# Altium schematic sheet ST_LINK_V2-1.SCHDOC: ST-LINK/V2-1 with support of SWD only
size A4; Author: N.P; CompanyName: STMicroelectronics; Organization: MCD/APPLIS/LMS; DocumentNumber: 3; SheetNumber: 3; SheetTotal: 13; Project: STM32F723e-DISCO
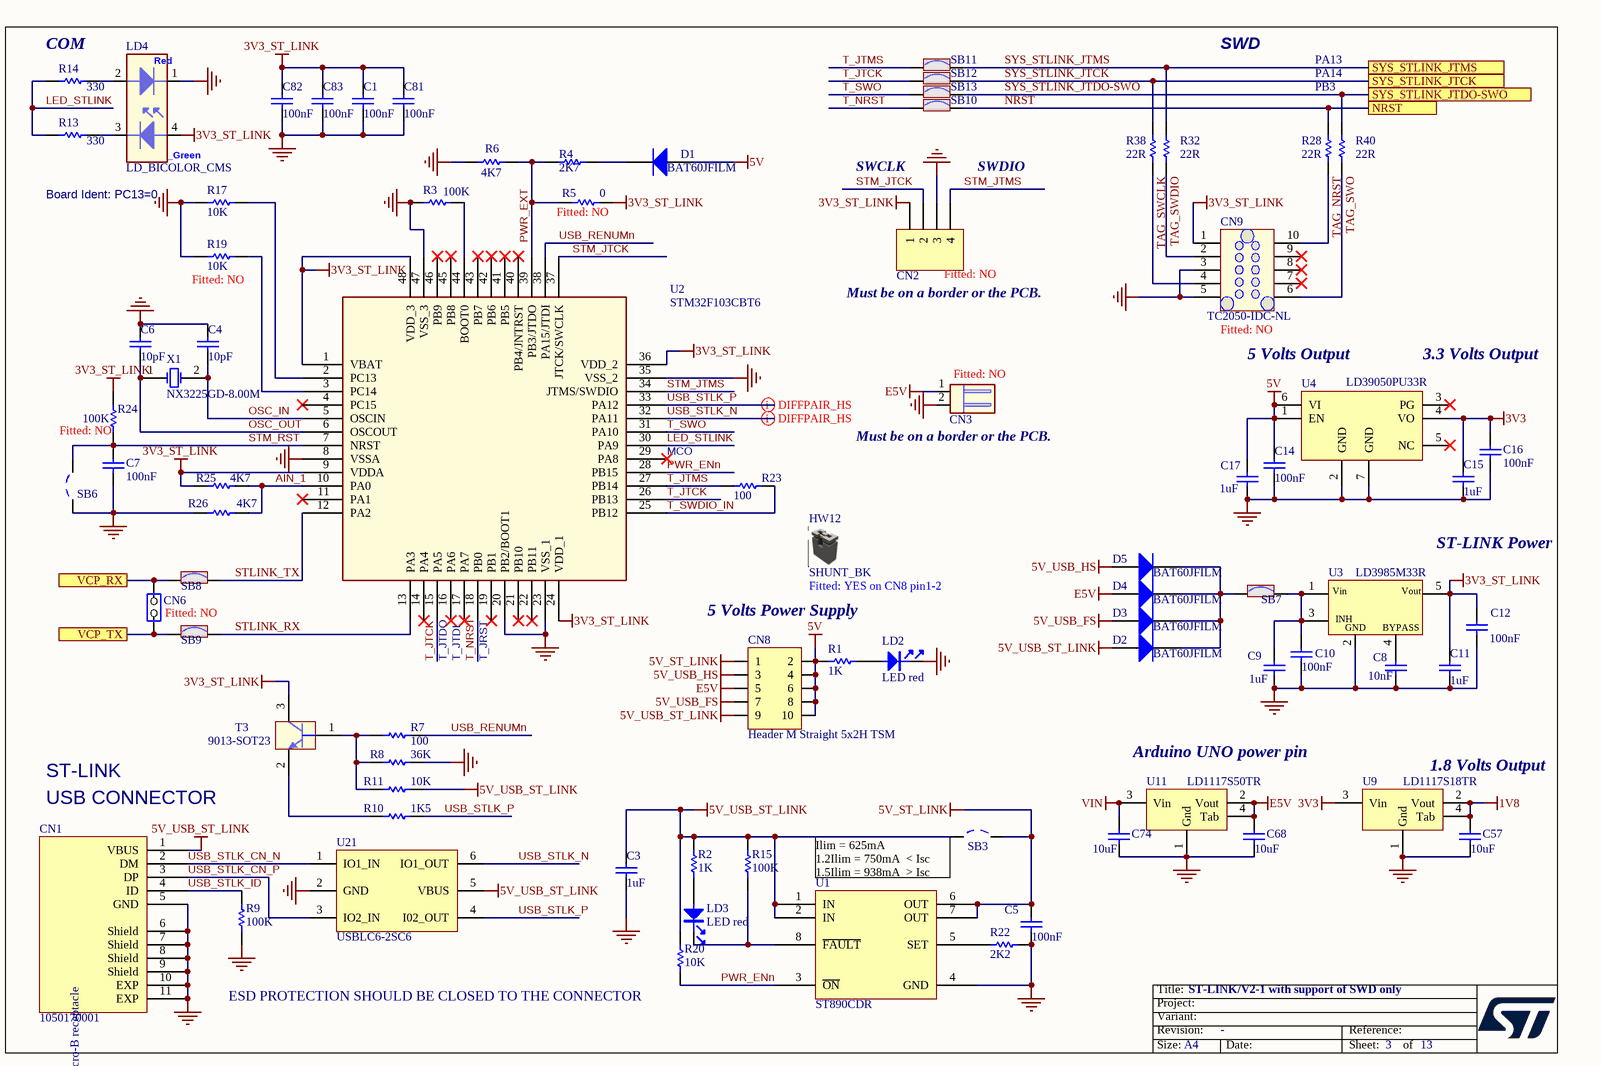
[diagram p0: ST_LINK_V2-1.SCHDOC]

## Parts
C1  100nF  [0402C]
C3  1uF  [0603C]
C4  10pF  [0402C]
C5  100nF  [0402C]
C6  10pF  [0402C]
C7  100nF  [0402C]
C8  value 10nF  [0603C]  (hidden comment: 10nF_X7R_10%_0603)
C9  1uF  [0603C]
C10  100nF  [0402C]
C11  1uF  [0603C]
C12  100nF  [0402C]
C14  100nF  [0402C]
C15  1uF  [0603C]
C16  100nF  [0402C]
C17  1uF  [0603C]
C57  10uF  [0603C]
C68  10uF  [0805C]
C74  10uF  [0805C]
C81  100nF  [0402C]
C82  100nF  [0402C]
C83  100nF  [0402C]
CN1  1050170001  [MICRO_USB_B_105017]
CN2  Fitted: NO  [HDR_1X4_2R54]  (hidden comment: Header 4)
CN3  Fitted: NO  [HDR_1X2_2R54_RA_11R35]  (hidden comment: WF25402-06421)
CN6  Fitted: NO  [SIP2]  (hidden comment: JP2)
CN8  Header M Straight 5x2H TSM  [TSM-105-01-S-DV]
CN9  TC2050-IDC-NL  Fitted: NO  [TC2050-IDC-NL]
D1  BAT60JFILM  [SOD-323]
D2  BAT60JFILM  [SOD-323]
D3  BAT60JFILM  [SOD-323]
D4  BAT60JFILM  [SOD-323]
D5  BAT60JFILM  [SOD-323]
HW12  SHUNT_BK  Fitted: YES on CN8 pin1-2  (mechanical)
LD2  LED red  [0603D]
LD3  LED red  [0603D]
LD4  LD_BICOLOR_CMS  [LED2_3528]
R1  1K  [0402R]
R2  1K  [0402R]
R3  value 100K  [0402R]  (hidden comment: 100K_1%_0402)
R4  2K7  [0402R]
R5  Fitted: NO  [0402R]  (hidden comment: 0)
R6  value 4K7  [0402R]  (hidden comment: 4K7_1%_0402)
R7  100  [0402R]
R8  36K  [0402R]
R9  value 100K  [0402R]  (hidden comment: 100K_1%_0402)
R10  1K5  [0402R]
R11  10K  [0402R]
R13  330  [0402R]
R14  330  [0402R]
R15  value 100K  [0402R]  (hidden comment: 100K_1%_0402)
R17  10K  [0402R]
R19  10K  Fitted: NO  [0402R]
R20  10K  [0402R]
R22  2K2  [0402R]
R23  100  [0402R]
R24  value 100K  Fitted: NO  [0402R]  (hidden comment: 100K_1%_0402)
R25  value 4K7  [0402R]  (hidden comment: 4K7_1%_0402)
R26  value 4K7  [0402R]  (hidden comment: 4K7_1%_0402)
R28  22R  [R0603]
R32  22R  [R0603]
R38  22R  [R0603]
R40  22R  [R0603]
SB3  Solder Bridge OFF  [JP2_SMD]  (value not drawn)
SB6  Solder Bridge OFF  [JP2_SMD]  (value not drawn)
SB7  Solder Bridge ON  [JP2_SMD]  (value not drawn)
SB8  Solder Bridge ON  [JP2_SMD]  (value not drawn)
SB9  Solder Bridge ON  [JP2_SMD]  (value not drawn)
SB10  Solder Bridge ON  [JP2_SMD]  (value not drawn)
SB11  Solder Bridge ON  [JP2_SMD]  (value not drawn)
SB12  Solder Bridge ON  [JP2_SMD]  (value not drawn)
SB13  Solder Bridge ON  [JP2_SMD]  (value not drawn)
T3  9013-SOT23  [SOT-23]
U1  ST890CDR  [SOIC8_1R27_4R9X6]
U2  STM32F103CBT6  [LQFP48_0R5_9X9]
U3  LD3985M33R  [SOT-23-5L]
U4  LD39050PU33R  [DFN6_0R95_3X3]
U9  LD1117S18TR  [SOT-223]
U11  LD1117S50TR  [SOT-223]
U21  USBLC6-2SC6  [SOT23-6]
X1  NX3225GD-8.00M  [XTAL_2SM_3R2X2R5_H1]

## Ports
NRST, SYS_STLINK_JTCK, SYS_STLINK_JTDO-SWO, SYS_STLINK_JTMS, VCP_RX, VCP_TX

## Nets
1V8: C57.2 U9.2(Vout) U9.4(Tab)
3V3: C15.2 C16.2 U4.4(VO) U9.3(Vin)
3V3_ST_LINK: C1.1 C11.2 C12.2 C81.2 C82.2 C83.2 CN2.1 CN9.1 LD4.4 R5.2 R24.2 R25.1 T3.3(C) U2.1(VBAT) U2.9(VDDA) U2.24(VDD_1) U2.36(VDD_2) U2.48(VDD_3) U3.5(Vout)
5V: C14.2 C17.2 CN8.2 CN8.4 CN8.6 CN8.8 CN8.10 D1.1(A) R1.1 U4.1(EN) U4.6(VI)
5V_ST_LINK: C5.2 CN8.1 SB3.2 U1.6(OUT) U1.7(OUT)
5V_USB_FS: CN8.7 D3.1(A)
5V_USB_HS: CN8.3 D5.1(A)
5V_USB_ST_LINK: C3.2 CN1.1(VBUS) CN8.9 D2.1(A) R2.2 R11.1 R15.2 R20.2 SB3.1 U1.1(IN) U1.2(IN) U21.5(VBUS)
E5V: C68.2 CN3.1 CN8.5 D4.1(A) U11.2(Vout) U11.4(Tab)
GND: C1.2 C3.1 C4.1 C5.1 C6.1 C7.1 C8.1 C9.1 C10.1 C11.1 C12.1 C14.1 C15.1 C16.1 C17.1 C57.1 C68.1 C74.1 C81.1 C82.1 C83.1 CN1.5(GND) CN1.6(Shield) CN1.7(Shield) CN1.8(Shield) CN1.9(Shield) CN1.10(EXP) CN1.11(EXP) CN2.3 CN3.2 CN9.3 CN9.5 LD2.2 LD4.1 R3.1 R6.1 R8.1 R9.1 R17.1 R19.1 R22.2 R26.1 SB6.1 U1.4(GND) U2.8(VSSA) U2.20(PB2/BOOT1) U2.23(VSS_1) U2.35(VSS_2) U2.47(VSS_3) U3.2(GND) U4.2(GND) U4.7(GND) U9.1(Gnd) U11.1(Gnd) U21.2(GND)
VIN: C74.2 U11.3(Vin)
AIN_1: R25.2 R26.2 U2.10(PA0)
LED_STLINK: R13.1 R14.1 U2.30(PA9)
NRST: R28.2 SB10.2 ; port NRST
OSC_IN: C4.2 U2.5(OSCIN) X1.2(OSC2)
OSC_OUT: C6.2 U2.6(OSCOUT) X1.1(OSC1)
PWR_ENn: R20.1 U1.3(~{ON}) U2.28(PB15)
PWR_EXT: R4.1 R5.1 R6.2 U2.39(PB3/JTDO)
STLINK_RX: SB9.2 U2.13(PA3)
STLINK_TX: SB8.2 U2.12(PA2)
STM_JTCK: CN2.2 U2.37(JTCK/SWCLK)
STM_JTMS: CN2.4 U2.34(JTMS/SWDIO)
STM_RST: C7.2 R24.1 SB6.2 U2.7(NRST)
SYS_STLINK_JTCK: R38.2 SB12.2 ; port SYS_STLINK_JTCK
SYS_STLINK_JTDO-SWO: R40.2 SB13.2 ; port SYS_STLINK_JTDO-SWO
SYS_STLINK_JTMS: R32.2 SB11.2 ; port SYS_STLINK_JTMS
T_JTCK: SB12.1 U2.15(PA5) U2.26(PB13)
T_JTMS: R23.1 SB11.1 U2.27(PB14)
T_NRST: SB10.1 U2.18(PB0)
T_SWDIO_IN: R23.2 U2.25(PB12)
T_SWO: SB13.1 U2.31(PA10)
TAG_NRST: CN9.10 R28.1
TAG_SWCLK: CN9.4 R38.1
TAG_SWDIO: CN9.2 R32.1
TAG_SWO: CN9.6 R40.1
USB_RENUMn: R7.2 U2.38(PA15/JTDI)
USB_STLK_CN_N: CN1.2(DM) U21.1(IO1_IN)
USB_STLK_CN_P: CN1.3(DP) U21.3(IO2_IN)
USB_STLK_ID: CN1.4(ID) R9.2
USB_STLK_N: U2.32(PA11) U21.6(IO1_OUT)
USB_STLK_P: R10.2 U2.33(PA12) U21.4(I02_OUT)
VCP_RX: CN6.2(NO) SB8.1 ; port VCP_RX
VCP_TX: CN6.1(COMMON) SB9.1 ; port VCP_TX
NetC8_2: C8.2 U3.4(BYPASS)
NetC9_2: C9.2 C10.2 SB7.2 U3.1(Vin) U3.3(CE)
NetD1_2: D1.2(K) R4.2
NetD2_2: D2.2(K) D3.2(K) D4.2(K) D5.2(K) SB7.1
NetLD2_1: LD2.1 R1.2
NetLD3_1: LD3.1 R2.1
NetLD3_2: LD3.2 R15.1 U1.8(~{FAULT})
NetLD4_2: LD4.2 R14.2
NetLD4_3: LD4.3 R13.2
NetR3_2: R3.2 U2.44(BOOT0)
NetR7_1: R7.1 R8.2 R11.2 T3.1(B)
NetR10_1: R10.1 T3.2(E)
NetR17_2: R17.2 U2.2(PC13)
NetR19_2: R19.2 U2.3(PC14)
NetR22_1: R22.1 U1.5(SET)

Not connected (* = marked no-connect by the designer): CN9 7* 8* 9*; U2 4(PC15)* 11(PA1)* 14(PA4)* 16(PA6)* 17(PA7)* 19(PB1)* 21(PB10)* 22(PB11)* 29(PA8)* 40(PB4/JNTRST)* 41(PB5)* 42(PB6)* 43(PB7)* 45(PB8)* 46(PB9)*; U4 3(PG)* 5(NC)*

## Layout directives
differential pair: USB_STLK_N, USB_STLK_P

## Notes on the sheet
- (near R14) COM
- SWD
- PA13
- PB3
- PA14
- Board Ident: PC13=0
- SWCLK
- SWDIO
- Must be on a border or the PCB.
- 5 Volts Output
- (near U4) 3.3 Volts Output
- MCO
- (near CN3) Must be on a border or the PCB.
- ST-LINK Power
- (near U2) T_JTDO
- (near U2) T_JTDI
- (near U2) T_JRST
- 5 Volts Power Supply
- ST-LINK
- (near CN1) USB CONNECTOR
- (near U11) Arduino UNO power pin
- (near U9) 1.8 Volts Output
- (near SB3) Ilim = 625mA
  1.2Ilim = 750mA  < Isc
  1.5Ilim = 938mA  > Isc
- ESD PROTECTION SHOULD BE CLOSED TO THE CONNECTOR
- Title:
- Project:
- Size:
- Revision:
- Variant:
- A4
- -
- Date:
- Reference:
- Sheet:
- of
- (in symbol 1050170001) USB_Micro-B receptacle
- (in symbol LD3985M33R) INH
- (in symbol LD_BICOLOR_CMS) Red; _Green

## Library data of the parts
C1 C5 C7 C10 C12 C14 C16 C81-C83 = Cap_100nF_X7R_10%_0402: Capacitor,100nF,16V,X7R,10%,0402,YAGEO; Manuf_Part_1: CC0402KRX7R7BB104; Ordered by: Subcon; Fitted: YES; Revision: July-2002: Re-released for DXP Platform.; Value: 100nF; Order: CC0402KRX7R7BB104; Manuf_1: YAGEO; ECCN_US/EU: n/a
C3 C9 C11 C15 C17 = Cap_1uF_X5R_10%_0603: Capacitor,1uF,16V,X5R,10%,0603,YAGEO; Manuf_Part_1: CC0603KRX5R7BB105; Ordered by: Subcon; Fitted: YES; Revision: July-2002: Re-released for DXP Platform.; Value: 1uF; Order: CC0603KRX5R7BB105; Manuf_1: YAGEO; ECCN_US/EU: n/a
C4 C6 = Cap_10pF_NPO_5%_0402: Capacitor,10pF,50V,NPO,5%,0402,YAGEO; Order: CC0402JRNPO9BN100; Ordered by: Subcon; Fitted: YES; Revision: July-2002: Re-released for DXP Platform.; Value: 10pF; Manuf_1: YAGEO; Manuf_Part_1: CC0402JRNPO9BN100; ECCN_US/EU: n/a
C8 = Cap_10nF_X7R_10%_0603: Capacitor,10nF,50V,X7R,10%,0603,YAGEO; Manuf_Part_1: CC0603KRX7R9BB103; Ordered by: Subcon; Fitted: YES; Revision: July-2002: Re-released for DXP Platform.; Order: CC0603KRX7R9BB103; Manuf_1: YAGEO; ECCN_US/EU: n/a
C57 = Cap_10uF_X5R_10%_0603: Capacitor,10uF,6.3V,X5R,10%,0603,YAGEO; Manuf_Part_1: CC0603KRX5R5BB106; Ordered by: Subcon; Fitted: YES; Revision: July-2002: Re-released for DXP Platform.; Value: 10uF; Order: CC0603KRX5R5BB106; Manuf_1: YAGEO; ECCN_US/EU: n/a
C68 C74 = Cap_10uF_X5R_10%_0805: Capacitor,10uF,25V,X5R,10%,0805,YAGEO; Manuf_Part_1: CC0805KRX5R8BB106; Ordered by: Subcon; Fitted: YES; Revision: July-2002: Re-released for DXP Platform.; Value: 10uF; Order: CC0805KRX5R8BB106; Manuf_1: YAGEO; ECCN_US/EU: n/a
CN1 = 1050170001: USB-MICRO-B, 1050170001, SMT, MOLEX; Ordered by: Subcon; Fitted: YES; ECCN_US/EU: n/a; Manuf_1: MOLEX; Manuf_Part_1: 1050170001; Distrib: DIGIKEY; SOFER_FP: MICRO_USB_B_105017
CN2 = Header 4: Header, 4-Pin; Ordered by: Subcon; Revision: 17-Jul-2002: Re-released for DXP Platform.; Publisher: Altium Limited; ECCN_US/EU: n/a; SOFER_FP: HDR_1X4_2R54
CN3 = JP2_RA: Header, 2-Pins, Single row, Right Angle, 2.54 mm pitch, DIP; Manuf_1: ATOM; Ordered by: Subcon; ECCN_US/EU: n/a; Manuf_Part_1: WF25402-06421; Distrib: SubCo
CN6 = JP2: Ordered by: Subcon; ECCN_US/EU: n/a
CN8 = Header 5X2M TSM: Header Male TSM, 5-Pin, Dual row, Straight, AMD; Manuf_Part_1: TSM-105-01-L-DV; Manuf_1: SAMTEC; Fitted: YES; Ordered by: Subcon; Distrib: Sub Co; Footprint: TSM-105-01-L-DV; ECCN_US/EU: n/a; SOFER_FP: TSM-105-01-L-DV
CN9 = Tag-10-C: Tag_Connector Header, 10-Pin, Dual row No legs; Manuf_Part_1: TC2050-IDC-NL-FP; Ordered_By: Subcon; Distrib: *; ECCN_US/EU: n/a; Manuf_1: Tag_connect; Order_code: *; Value: TC2050-IDC-NL; Ordered by: Subcon
D1-D5 = BAT60JFILM: Manuf_1: STM; Provided: ST; ECCN_US/EU: EAR99/NEC; Ref St: 9151097; Fitted: YES; Revision: July-2002: Re-released for DXP Platform.; Order: BAT60JFILM; Manuf_Part_1: BAT60JFILM; Distrib: ST; Ordered by: ST
HW12 = Shunt 2.54mm: SHUNT 2.54mm BLACK; Manuf_1: SAMTEC; Manuf_Part_1: SNT-100-BK-G; Ordered_By: Subcon; ECCN_US/EU: n/a; Distrib: *; Order_Code: *; Value: SHUNT_BK; Ordered by: Subcon
LD2 LD3 = LED_red: LED red 0603; Manuf_1: everlight; Manuf_Part_1: 19-213-R6C-AP1Q2B/3T; Ordered by: Subcon; Fitted: YES; Order: 19-213-R6C-AP1Q2B/3T; ECCN_US/EU: n/a
LD4 = LD_BICOLOR_CMS: Bicolor Led; Manuf_Part_1: HSMF-A201-A00J1; Manuf_1: Avago Technologies; Manuf_2: everluck; Manuf_Part_2: LE-RGW35280; Ref St: xxxxxx; Ordered by: Subcon; Fitted: YES; Distrib: RADIOSPARES; Footprint: HSMF-A201; ECCN_US/EU: n/a
R1 R2 = Res_1K_1%_0402: Resistor,1K,0402,1%,YAGEO; Manuf_Part_1: RC0402FR-071KL; Ordered by: Subcon; Fitted: YES; Value: 1K; Manuf_1: YAGEO; Order: RC0402FR-071KL; ECCN_US/EU: n/a
R3 R9 R15 = Res_100K_1%_0402: Resistor,100K,0402,1%,YAGEO; Manuf_Part_1: RC0402FR-07100KL; Manuf_Part_2: RT0402FRE07100KL; Ordered by: Subcon; Fitted: YES; Manuf_1: YAGEO; ECCN_US/EU: n/a; Manuf_2: YAGEO
R4 = Res_2K7_1%_0402: Resistor,2K7,0402,1%,YAGEO; Manuf_Part_1: RC0402FR-072K7L; Ordered by: Subcon; Fitted: YES; Value: 2K7; Manuf_1: YAGEO; Order: RC0402FR-072K7L; ECCN_US/EU: n/a; Distrib: FARNELL
R5 = Res_0_5%_0402: Resistor,0,0402,5%,YAGEO; Manuf_Part_1: RC0402JR-070RL; Order: 2363467; Ordered by: Subcon; Value: 0; ECCN_US/EU: n/a; Manuf_1: YAGEO; Distrib: FARNELL
R6 R25 R26 = Res_4K7_1%_0402: Resistor,4K7,0402,1%,YAGEO; Manuf_Part_1: RC0402FR-074K7L; Manuf_Part_2: RT0402FRE074K7L; Ordered by: Subcon; Fitted: YES; Manuf_1: YAGEO; ECCN_US/EU: n/a; Manuf_2: YAGEO
R7 R23 = Res_100_1%_0402: Resistor,100,0402,1%,YAGEO; Manuf_Part_1: RC0402FR-07100RL; Order: 9239111; Ordered by: Subcon; Fitted: YES; Value: 100; Manuf_1: YAGEO; ECCN_US/EU: n/a; Distrib: FARNELL
R8 = Res_36K_1%_0402: Resistor,36K,0402,1%,YAGEO; Manuf_Part_1: RC0402FR-0736KL; Ordered by: Subcon; Fitted: YES; Value: 36K; Manuf_1: YAGEO; Order: RC0402FR-0736KL; ECCN_US/EU: n/a; Distrib: FARNELL
R10 = Res_1K5_1%_0402: Resistor,1K5,0402,1%,YAGEO; Manuf_Part_1: RC0402FR-071K5L; Ordered by: Subcon; Fitted: YES; Value: 1K5; Manuf_1: YAGEO; Order: RC0402FR-071K5L; ECCN_US/EU: n/a; Distrib: FARNELL
R11 R17 R20 = Res_10K_1%_0402: Resistor,10K,0402,1%,YAGEO; Manuf_Part_1: RC0402FR-0710KL; Ordered by: Subcon; Fitted: YES; Value: 10K; Manuf_1: YAGEO; Order: RC0402FR-0710KL; ECCN_US/EU: n/a
R13 R14 = Res_330_1%_0402: Resistor,330,0402,1%,YAGEO; Manuf_Part_1: RC0402FR-07330RL; Ordered by: Subcon; Fitted: YES; Value: 330; ECCN_US/EU: n/a; Manuf_1: YAGEO; Distrib: DIGIKEY; Order: RC0402FR-07330RL
R19 = Res_10K_1%_0402: Resistor,10K,0402,1%,YAGEO; Manuf_Part_1: RC0402FR-0710KL; Ordered by: Subcon; Value: 10K; Manuf_1: YAGEO; Order: RC0402FR-0710KL; ECCN_US/EU: n/a
R22 = Res_2K2_1%_0402: Resistor,2K2,0402,1%,YAGEO; Manuf_Part_1: RC0402FR-072K2L; Ordered by: Subcon; Fitted: YES; Value: 2K2; Manuf_1: YAGEO; Order: RC0402FR-072K2L; ECCN_US/EU: n/a
R24 = Res_100K_1%_0402: Resistor,100K,0402,1%,YAGEO; Manuf_Part_1: RC0402FR-07100KL; Manuf_Part_2: RT0402FRE07100KL; Ordered by: Subcon; Manuf_1: YAGEO; ECCN_US/EU: n/a; Manuf_2: YAGEO
R28 R32 R38 R40 = Res_22_1%_0603: Resistor,22R,0603,1%,Yageo; Manuf_Part_1: RC0603FR-0722RL; Fitted: YES; Ordered_By: Subcon; Value: 22R; ECCN_US/EU: n/a; Manuf_1: Yageo; Order_Code: RC0603FR-0722RL; Distrib: *; Ordered by: Subcon
SB3 SB6 = SB_OFF: Fitted: NO; Ordered by: Subcon; Revision: July-2002: Re-released for DXP Platform.; ECCN_US/EU: n/a
SB7-SB13 = SB_ON: Fitted: YES; Ordered by: Subcon; Revision: July-2002: Re-released for DXP Platform.; ECCN_US/EU: n/a
T3 = 9013-SOT23: NPN Bipolar Transistor; Manuf_1: NXP; Manuf_Part_1: BSR14; Order: 1081310; Ordered by: Subcon; Fitted: YES; Revision: July-2002: Re-released for DXP Platform.; Distrib: FARNELL; ECCN_US/EU: n/a
U1 = ST890CDR: 1.2 A current limited high-side power switch with thermal shutdown; Manuf_1: STM; ECCN_US/EU: EAR99/NEC; Provided: ST; Fitted: YES; Manuf_Part_1: ST890CDR; Distrib: ST; Footprint: SO-8; Ordered by: ST
U2 = STM32F103CBT6: Medium-density performance line ARM-based 32-bit MCU with 128KB Flash; Manuf_1: STM; Ref St: xxxxxxxx; Provided: ST; ECCN_US/EU: 3A991A2/NEC; Fitted: YES; Footprint: QFP48 7X7; Manuf_Part_1: STM32F103CBT6; Order: STM32F103CBT6; Distrib: ST; Ordered by: ST
U3 = LD3985M33R: Ultra low drop-low noise BiCMOS voltage, regulators low ESR capacitors compatible; Manuf_1: STM; Provided: ST; Ref St: 9176161; ECCN_US/EU: EAR99/NEC; Fitted: YES; Manuf_Part_1: LD3985M33R; Distrib: ST; Order: LD3985M33R; Ordered by: ST
U4 = LD39050P: Ultra low drop-low , 500 mA low quiescent current; Manuf_1: STM; Provided: ST; ECCN_US/EU: EAR99/NEC; Ref St: xxxxxxxx; Fitted: YES; Distrib: ST; Manuf_Part_1: LD39050PU33R; Order: LD39050PU33R; Ordered by: ST
U9 = LD1117S18TR: LOW DROP FIXED AND ADJUSTABLE POSITIVE VOLTAGE REGULATORS (1.8 Volts); Manuf_1: STM; Ref St: 9176180; ECCN_US/EU: EAR99/NEC; Provided: ST; Fitted: YES; Manuf_Part_1: LD1117S18TR; Order: LD1117S18TR; Distrib: ST; Ordered by: ST
U11 = LD1117S50TR: IC REG LDO 5V 0.8A SOT223; Manuf_1: STM; Ordered by: ST; ECCN_US/EU: EAR99/NEC; Ref St: 9176133; Fitted: YES; Manuf_Part_1: LD1117S50TR; Distrib: ST; Order: LD1117S50TR; Provided: ST
U21 = USBLC6-2SC6: Very low capacitance ESD protection; Manuf_1: STM; Provided: ST; ECCN_US/EU: EAR99/NEC; Fitted: YES; Manuf_Part_1: USBLC6-2SC6; Distrib: ST; Ordered by: ST
X1 = XTAL_8M_NX3225GD: Crystal 8Mhz, 8pF, -+50PPM, SMD; Manuf_1: NDK; Manuf_Part_1: NX3225GD 8MHz EXS00A-CG04874; Manuf_Part_2: NX3225GD-8.000M-STD-CRA-3; ECCN_US/EU: EAR99/NEC; NDK Ref: X3127326; Ref St: 9157029; Provided: ST; Fitted: YES; Order: NX3225GD 8MHz EXS00A-CG04874; Ordered by: ST